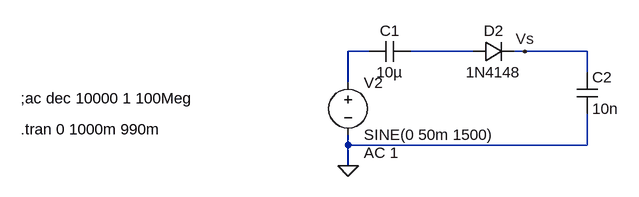
[diagram p0: schematic SMeter Detector.asc]
SMeter Detector.asc, the LTspice schematic file:
Version 4
SHEET 1 1416 708
WIRE 688 112 656 112
WIRE 848 112 752 112
WIRE 928 112 912 112
WIRE 1024 112 928 112
WIRE 1024 144 1024 112
WIRE 656 160 656 112
WIRE 656 256 656 240
WIRE 1024 256 1024 208
WIRE 1024 256 656 256
WIRE 656 288 656 256
FLAG 656 288 0
FLAG 928 112 Vs
SYMBOL voltage 656 144 R0
WINDOW 123 24 124 Left 2
WINDOW 39 0 0 Left 2
SYMATTR Value2 AC 1
SYMATTR InstName V2
SYMATTR Value SINE(0 50m 1500)
SYMBOL diode 848 128 R270
WINDOW 0 32 32 VTop 2
WINDOW 3 0 32 VBottom 2
SYMATTR InstName D2
SYMATTR Value 1N4148
SYMBOL cap 752 96 R90
WINDOW 0 0 32 VBottom 2
WINDOW 3 32 32 VTop 2
SYMATTR InstName C1
SYMATTR Value 10µ
SYMBOL cap 1008 144 R0
SYMATTR InstName C2
SYMATTR Value 10n
TEXT 152 232 Left 2 !.tran 0 1000m 990m
TEXT 152 184 Left 2 !;ac dec 10000 1 100Meg

The netlist it stands for:
* SMeter Detector.asc
V2 N001 0 SINE(0 50m 1500) AC 1
D2 N002 Vs 1N4148
C1 N002 N001 10µ
C2 Vs 0 10n
.model D D
.lib standard.dio
.tran 0 1000m 990m
;ac dec 10000 1 100Meg
.backanno
.end